# EAGLE schematic Transistor (EAGLE 7.7.0)
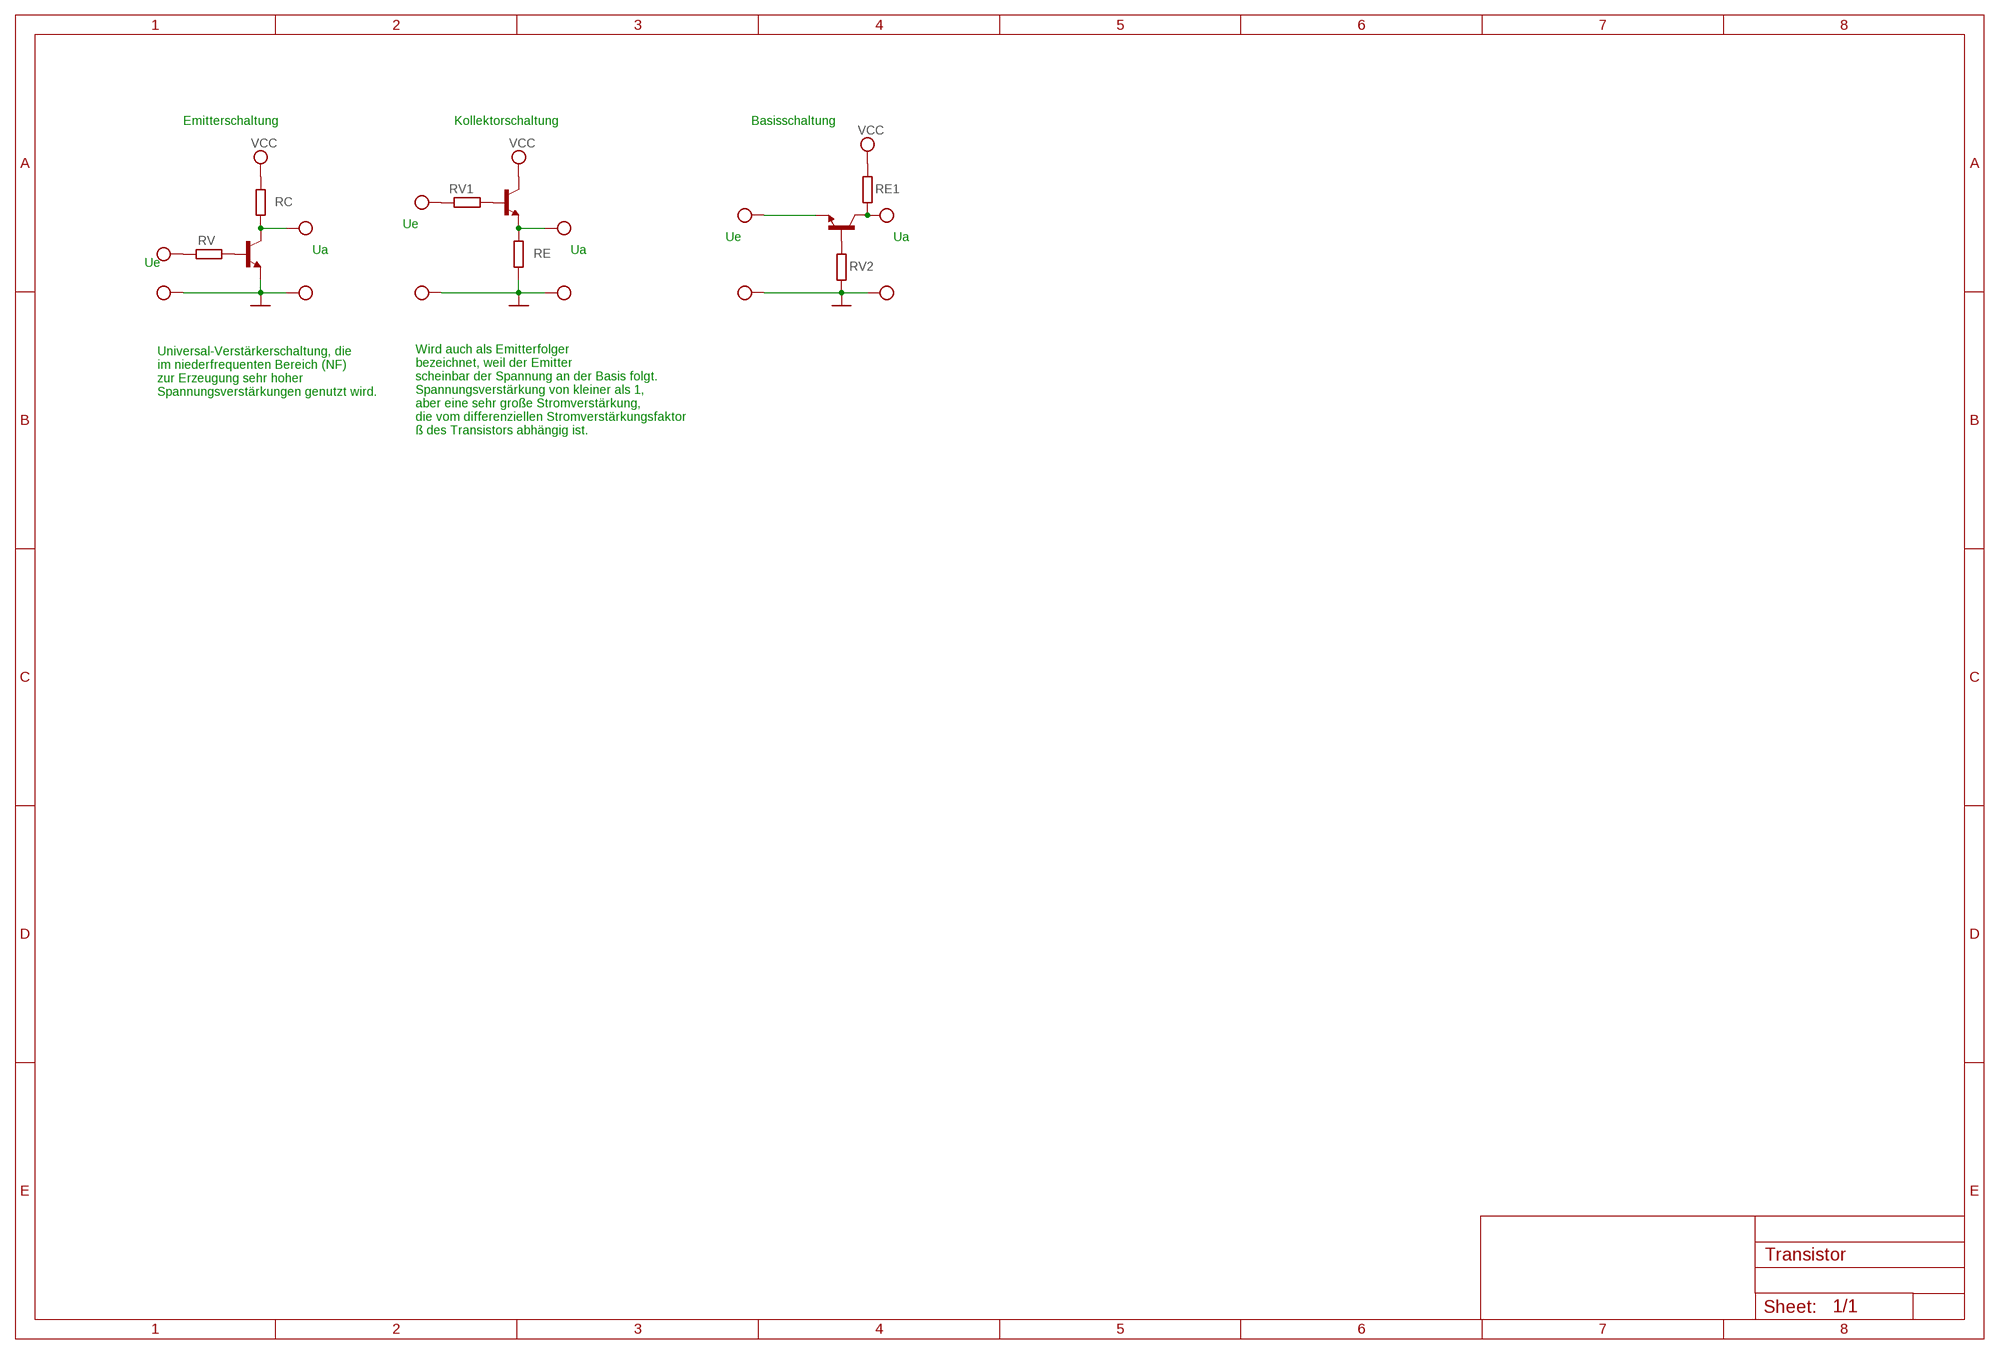
[diagram p0: schematic, sheet 1]

## Parts
RC  R-EU_0204/2V  [0204V]
RE  R-EU_0204/2V  [0204V]
RE1  R-EU_0204/2V  [0204V]
RV  R-EU_0204/2V  [0204V]
RV1  R-EU_0204/2V  [0204V]
RV2  R-EU_0204/2V  [0204V]
T1  -NPN-TO92  [TO92]
T2  -NPN-TO92  [TO92]
T3  -NPN-TO92  [TO92]

## Nets
GND: RE.1 RV2.1 T1.1(E) ; supply symbol labelled VEE
N$1: RV1.1 T2.2(B)
N$2: RV.1 T1.2(B)
N$3: RV2.2 T3.2(B)
VEE: RC.1 RC.2 RE1.1 RE1.2 RE.2 RV1.2 RV.2 T1.3(C) T2.1(E) T2.3(C) T3.1(E) T3.3(C) ; supply symbol labelled VCC

## Notes on the sheet
- Emitterschaltung | Kollektorschaltung | Basisschaltung
- Ue
- Ue | Ua
- Ua | Ua
- Ue
- Universal-Verstärkerschaltung, die
  im niederfrequenten Bereich (NF)
  zur Erzeugung sehr hoher
  Spannungsverstärkungen genutzt wird.
- Wird auch als Emitterfolger
  bezeichnet, weil der Emitter
  scheinbar der Spannung an der Basis folgt. 
  Spannungsverstärkung von kleiner als 1,
  aber eine sehr große Stromverstärkung,
  die vom differenziellen Stromverstärkungsfaktor
  ß des Transistors abhängig ist.

## Library data of the parts
RC RE RE1 RV RV1 RV2 = rcl:R-EU_: RESISTOR, European symbol
T1-T3 = transistor:*-NPN-: NPN Transistror BF959 corrected 2008.03.06